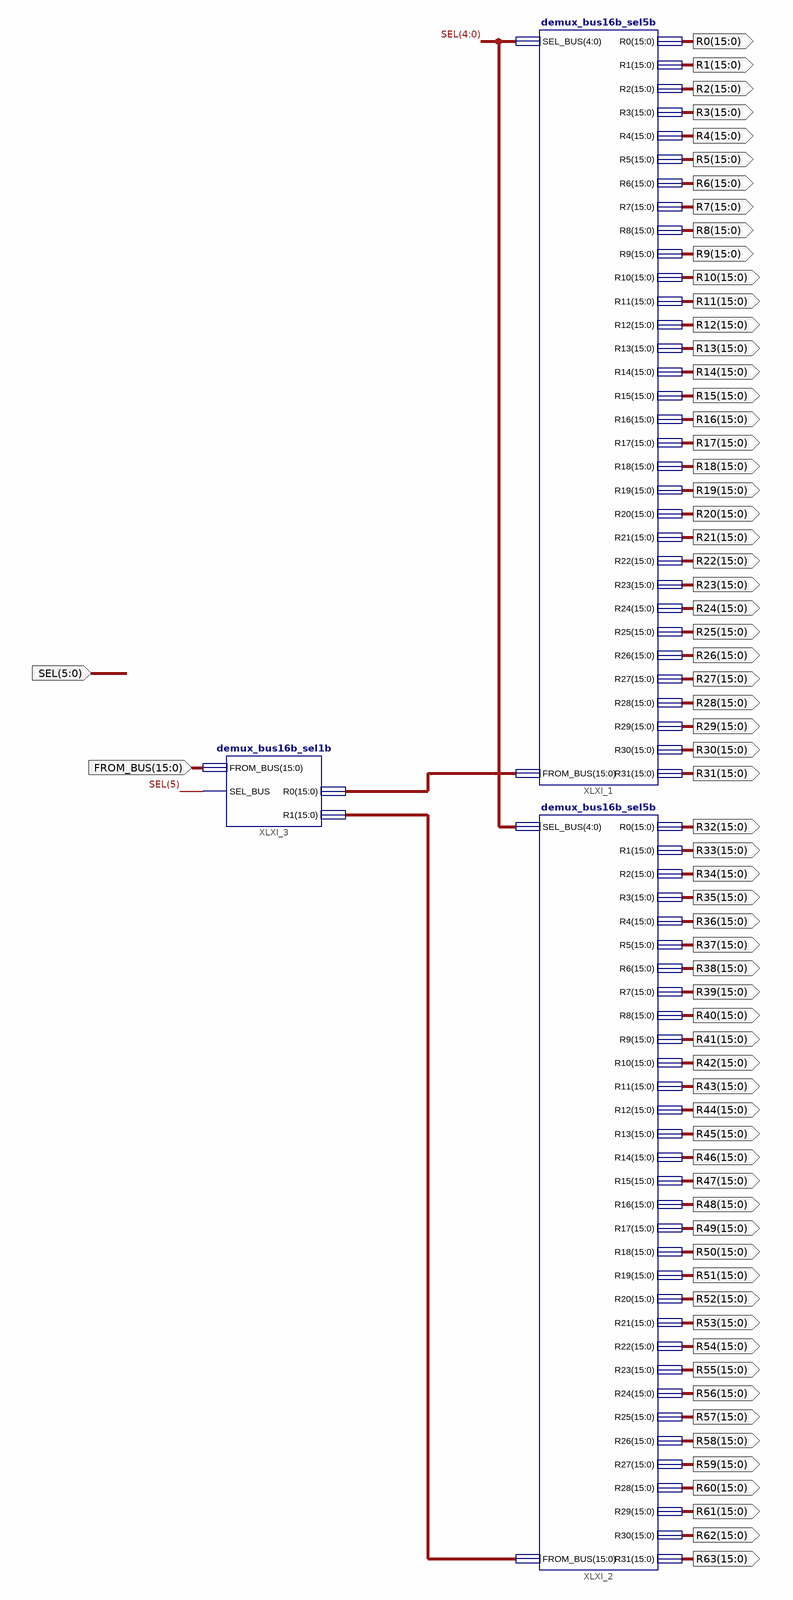
[diagram p0: schematic sheet 1]
// Xilinx ISE schematic demux_bus16b_sel6b.sch (artix7) as structural Verilog: 3 symbols, 66 ports
module demux_bus16b_sel6b (
  input  [15:0] FROM_BUS,
  input  [5:0] SEL,
  output [15:0] R0,
  output [15:0] R1,
  output [15:0] R2,
  output [15:0] R3,
  output [15:0] R4,
  output [15:0] R5,
  output [15:0] R6,
  output [15:0] R7,
  output [15:0] R8,
  output [15:0] R9,
  output [15:0] R10,
  output [15:0] R11,
  output [15:0] R12,
  output [15:0] R13,
  output [15:0] R14,
  output [15:0] R15,
  output [15:0] R16,
  output [15:0] R17,
  output [15:0] R18,
  output [15:0] R19,
  output [15:0] R20,
  output [15:0] R21,
  output [15:0] R22,
  output [15:0] R23,
  output [15:0] R24,
  output [15:0] R25,
  output [15:0] R26,
  output [15:0] R27,
  output [15:0] R28,
  output [15:0] R29,
  output [15:0] R30,
  output [15:0] R31,
  output [15:0] R32,
  output [15:0] R33,
  output [15:0] R34,
  output [15:0] R35,
  output [15:0] R36,
  output [15:0] R37,
  output [15:0] R38,
  output [15:0] R39,
  output [15:0] R40,
  output [15:0] R41,
  output [15:0] R42,
  output [15:0] R43,
  output [15:0] R44,
  output [15:0] R45,
  output [15:0] R46,
  output [15:0] R47,
  output [15:0] R48,
  output [15:0] R49,
  output [15:0] R50,
  output [15:0] R51,
  output [15:0] R52,
  output [15:0] R53,
  output [15:0] R54,
  output [15:0] R55,
  output [15:0] R56,
  output [15:0] R57,
  output [15:0] R58,
  output [15:0] R59,
  output [15:0] R60,
  output [15:0] R61,
  output [15:0] R62,
  output [15:0] R63
);

  wire [15:0] XLXN_1, XLXN_2;

  demux_bus16b_sel5b XLXI_1 (
    .SEL_BUS(SEL[4:0]), .FROM_BUS(XLXN_2), .R0(R0), .R1(R1), .R2(R2), .R3(R3), .R4(R4), .R5(R5), .R6(R6),
    .R7(R7), .R8(R8), .R9(R9), .R10(R10), .R11(R11), .R12(R12), .R13(R13), .R14(R14), .R15(R15), .R16(R16),
    .R17(R17), .R18(R18), .R19(R19), .R20(R20), .R21(R21), .R22(R22), .R23(R23), .R24(R24), .R25(R25),
    .R26(R26), .R27(R27), .R28(R28), .R29(R29), .R30(R30), .R31(R31));
  demux_bus16b_sel5b XLXI_2 (
    .SEL_BUS(SEL[4:0]), .FROM_BUS(XLXN_1), .R0(R32), .R1(R33), .R2(R34), .R3(R35), .R4(R36), .R5(R37),
    .R6(R38), .R7(R39), .R8(R40), .R9(R41), .R10(R42), .R11(R43), .R12(R44), .R13(R45), .R14(R46), .R15(R47),
    .R16(R48), .R17(R49), .R18(R50), .R19(R51), .R20(R52), .R21(R53), .R22(R54), .R23(R55), .R24(R56),
    .R25(R57), .R26(R58), .R27(R59), .R28(R60), .R29(R61), .R30(R62), .R31(R63));
  demux_bus16b_sel1b XLXI_3 (.SEL_BUS(SEL[5]), .FROM_BUS(FROM_BUS), .R0(XLXN_2), .R1(XLXN_1));
endmodule
